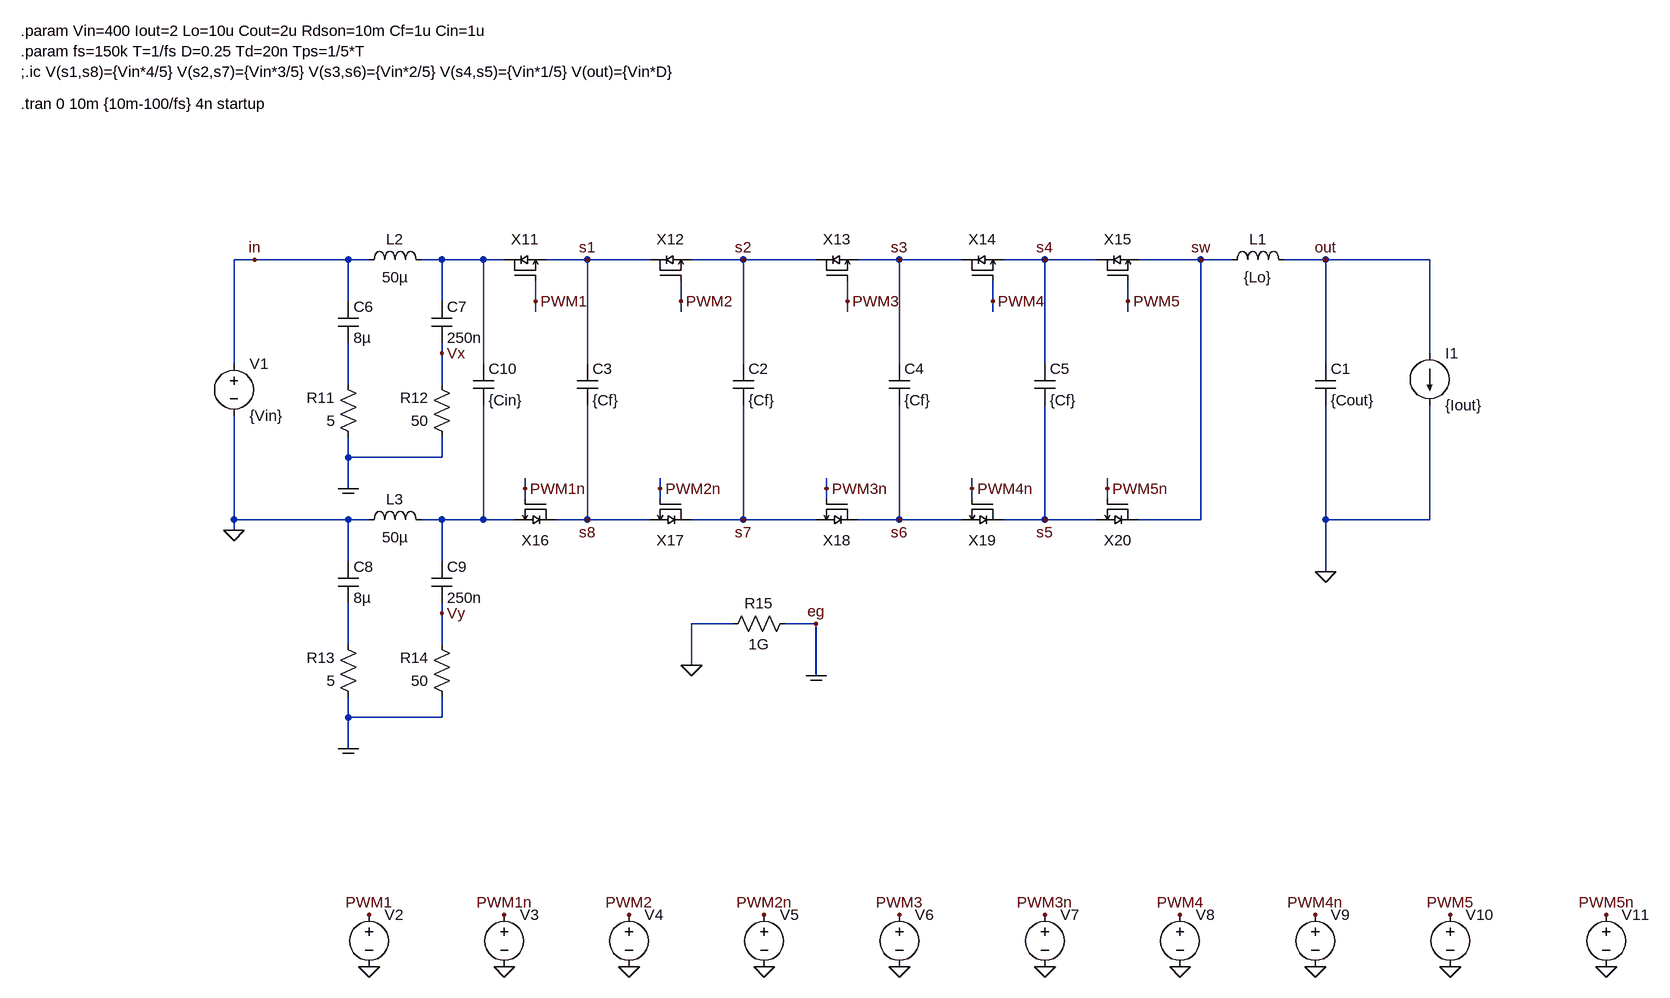
[diagram p0: schematic FCMLEMI.asc]
FCMLEMI.asc, the LTspice schematic file:
Version 4
SHEET 1 1772 988
WIRE -496 -176 -528 -176
WIRE -352 -176 -496 -176
WIRE -320 -176 -352 -176
WIRE -208 -176 -240 -176
WIRE -144 -176 -208 -176
WIRE -112 -176 -144 -176
WIRE 16 -176 -48 -176
WIRE 112 -176 16 -176
WIRE 256 -176 176 -176
WIRE 368 -176 256 -176
WIRE 496 -176 432 -176
WIRE 592 -176 496 -176
WIRE 720 -176 656 -176
WIRE 800 -176 720 -176
WIRE 960 -176 864 -176
WIRE 1008 -176 960 -176
WIRE 1152 -176 1088 -176
WIRE 1312 -176 1152 -176
WIRE -352 -112 -352 -176
WIRE -208 -112 -208 -176
WIRE -64 -112 -64 -144
WIRE 160 -112 160 -144
WIRE 416 -112 416 -144
WIRE 640 -112 640 -144
WIRE 848 -112 848 -144
WIRE -64 -96 -64 -112
WIRE 160 -96 160 -112
WIRE 416 -96 416 -112
WIRE 640 -96 640 -112
WIRE 848 -96 848 -112
WIRE -208 -32 -208 -48
WIRE 1312 -32 1312 -176
WIRE -528 -16 -528 -176
WIRE -144 -16 -144 -176
WIRE 16 -16 16 -176
WIRE 256 -16 256 -176
WIRE 496 -16 496 -176
WIRE 720 -16 720 -176
WIRE 1152 -16 1152 -176
WIRE -352 16 -352 -48
WIRE -208 16 -208 -32
WIRE -352 128 -352 96
WIRE -208 128 -208 96
WIRE -208 128 -352 128
WIRE -352 176 -352 128
WIRE -80 176 -80 160
WIRE 128 176 128 160
WIRE 384 176 384 160
WIRE 608 176 608 160
WIRE 816 176 816 160
WIRE -80 192 -80 176
WIRE 128 192 128 176
WIRE 384 192 384 176
WIRE 608 192 608 176
WIRE 816 192 816 176
WIRE -528 224 -528 64
WIRE -352 224 -528 224
WIRE -320 224 -352 224
WIRE -208 224 -240 224
WIRE -144 224 -144 48
WIRE -144 224 -208 224
WIRE -96 224 -144 224
WIRE 16 224 16 48
WIRE 16 224 -32 224
WIRE 112 224 16 224
WIRE 256 224 256 48
WIRE 256 224 176 224
WIRE 368 224 256 224
WIRE 496 224 496 48
WIRE 496 224 432 224
WIRE 592 224 496 224
WIRE 720 224 720 48
WIRE 720 224 656 224
WIRE 800 224 720 224
WIRE 960 224 960 -176
WIRE 960 224 864 224
WIRE 1152 224 1152 48
WIRE 1312 224 1312 48
WIRE 1312 224 1152 224
WIRE -528 240 -528 224
WIRE -352 288 -352 224
WIRE -208 288 -208 224
WIRE 1152 304 1152 224
WIRE -208 368 -208 352
WIRE 240 384 176 384
WIRE 368 384 320 384
WIRE -352 416 -352 352
WIRE -208 416 -208 368
WIRE 176 448 176 384
WIRE 368 464 368 384
WIRE -352 528 -352 496
WIRE -208 528 -208 496
WIRE -208 528 -352 528
WIRE -352 576 -352 528
FLAG -528 240 0
FLAG -320 832 PWM1
FLAG -112 832 PWM1n
FLAG 80 832 PWM2
FLAG 288 832 PWM2n
FLAG -496 -176 in
FLAG 960 -176 sw
FLAG 1152 -176 out
FLAG 128 176 PWM2n
FLAG 416 -112 PWM3
FLAG 384 176 PWM3n
FLAG -64 -112 PWM1
FLAG -80 176 PWM1n
FLAG 496 832 PWM3
FLAG 720 832 PWM3n
FLAG 640 -112 PWM4
FLAG 608 176 PWM4n
FLAG 928 832 PWM4
FLAG 1136 832 PWM4n
FLAG 160 -112 PWM2
FLAG 848 -112 PWM5
FLAG 816 176 PWM5n
FLAG 1344 832 PWM5
FLAG 1584 832 PWM5n
FLAG 16 -176 s1
FLAG 256 -176 s2
FLAG 496 -176 s3
FLAG 720 -176 s4
FLAG 720 224 s5
FLAG 496 224 s6
FLAG 256 224 s7
FLAG 16 224 s8
FLAG -112 912 0
FLAG -352 176 COM
FLAG -208 -32 Vx
FLAG -352 576 COM
FLAG -208 368 Vy
FLAG 176 448 0
FLAG 368 464 COM
FLAG -320 912 0
FLAG 80 912 0
FLAG 288 912 0
FLAG 496 912 0
FLAG 720 912 0
FLAG 1136 912 0
FLAG 928 912 0
FLAG 1344 912 0
FLAG 1584 912 0
FLAG 1152 304 0
FLAG 368 384 eg
SYMBOL voltage -528 -32 R0
WINDOW 123 0 0 Left 0
WINDOW 39 0 0 Left 0
SYMATTR InstName V1
SYMATTR Value {Vin}
SYMBOL ind 992 -160 R270
WINDOW 0 32 56 VTop 2
WINDOW 3 5 56 VBottom 2
SYMATTR InstName L1
SYMATTR Value {Lo}
SYMATTR SpiceLine Rser=9.33m
SYMBOL cap 1136 -16 R0
SYMATTR InstName C1
SYMATTR Value {Cout}
SYMATTR SpiceLine Rser=1m
SYMBOL cap 240 -16 R0
SYMATTR InstName C2
SYMATTR Value {Cf}
SYMATTR SpiceLine Rser=4.3m
SYMBOL voltage -320 816 R0
WINDOW 3 24 96 Invisible 2
WINDOW 123 0 0 Left 0
WINDOW 39 0 0 Left 0
SYMATTR Value PULSE(0 5 0 1n 1n {D*T} {T})
SYMATTR InstName V2
SYMBOL voltage -112 816 R0
WINDOW 3 24 96 Invisible 2
WINDOW 123 0 0 Left 0
WINDOW 39 0 0 Left 0
SYMATTR Value PULSE(0 5 {D*T+Td} 1n 1n {T-D*T-2*Td} {T})
SYMATTR InstName V3
SYMBOL voltage 80 816 R0
WINDOW 3 24 96 Invisible 2
WINDOW 123 0 0 Left 0
WINDOW 39 0 0 Left 0
SYMATTR Value PULSE(0 5 {Tps} 1n 1n {D*T} {T})
SYMATTR InstName V4
SYMBOL voltage 288 816 R0
WINDOW 3 24 96 Invisible 2
WINDOW 123 0 0 Left 0
WINDOW 39 0 0 Left 0
SYMATTR Value PULSE(0 5 {Tps+D*T+Td} 1n 1n {T-D*T-2*Td} {T})
SYMATTR InstName V5
SYMBOL cap 0 -16 R0
SYMATTR InstName C3
SYMATTR Value {Cf}
SYMATTR SpiceLine Rser=4.3m
SYMBOL voltage 496 816 R0
WINDOW 3 24 96 Invisible 2
WINDOW 123 0 0 Left 0
WINDOW 39 0 0 Left 0
SYMATTR Value PULSE(0 5 {Tps*2} 1n 1n {D*T} {T})
SYMATTR InstName V6
SYMBOL voltage 720 816 R0
WINDOW 3 24 96 Invisible 2
WINDOW 123 0 0 Left 0
WINDOW 39 0 0 Left 0
SYMATTR Value PULSE(0 5 {Tps*2+D*T+Td} 1n 1n {T-D*T-2*Td} {T})
SYMATTR InstName V7
SYMBOL cap 480 -16 R0
SYMATTR InstName C4
SYMATTR Value {Cf}
SYMATTR SpiceLine Rser=4.3m
SYMBOL voltage 928 816 R0
WINDOW 3 24 96 Invisible 2
WINDOW 123 0 0 Left 0
WINDOW 39 0 0 Left 0
SYMATTR Value PULSE(0 5 {Tps*3} 1n 1n {D*T} {T})
SYMATTR InstName V8
SYMBOL voltage 1136 816 R0
WINDOW 3 24 96 Invisible 2
WINDOW 123 0 0 Left 0
WINDOW 39 0 0 Left 0
SYMATTR Value PULSE(0 5 {Tps*3+D*T+Td} 1n 1n {T-D*T-2*Td} {T})
SYMATTR InstName V9
SYMBOL cap 704 -16 R0
SYMATTR InstName C5
SYMATTR Value {Cf}
SYMATTR SpiceLine Rser=4.3m
SYMBOL voltage 1344 816 R0
WINDOW 3 24 96 Invisible 2
WINDOW 123 0 0 Left 0
WINDOW 39 0 0 Left 0
SYMATTR Value PULSE(0 5 {Tps*4} 1n 1n {D*T} {T})
SYMATTR InstName V10
SYMBOL voltage 1584 816 R0
WINDOW 3 24 96 Invisible 2
WINDOW 123 0 0 Left 0
WINDOW 39 0 0 Left 0
SYMATTR Value PULSE(0 5 {Tps*4+D*T+Td} 1n 1n {T-D*T-2*Td} {T})
SYMATTR InstName V11
SYMBOL current 1312 -32 R0
WINDOW 123 0 0 Left 0
WINDOW 39 0 0 Left 0
SYMATTR InstName I1
SYMATTR Value {Iout}
SYMBOL IdealSW -80 -160 R0
SYMATTR InstName X11
SYMBOL IdealSW 144 -160 R0
SYMATTR InstName X12
SYMBOL IdealSW 400 -160 R0
SYMATTR InstName X13
SYMBOL IdealSW 624 -160 R0
SYMATTR InstName X14
SYMBOL IdealSW 832 -160 R0
SYMATTR InstName X15
SYMBOL IdealSW -64 208 R180
SYMATTR InstName X16
SYMBOL IdealSW 144 208 R180
SYMATTR InstName X17
SYMBOL IdealSW 400 208 R180
SYMATTR InstName X18
SYMBOL IdealSW 624 208 R180
SYMATTR InstName X19
SYMBOL IdealSW 832 208 R180
SYMATTR InstName X20
SYMBOL res -336 112 R180
WINDOW 0 36 76 Left 2
WINDOW 3 36 40 Left 2
SYMATTR InstName R11
SYMATTR Value 5
SYMBOL res -192 112 R180
WINDOW 0 36 76 Left 2
WINDOW 3 36 40 Left 2
SYMATTR InstName R12
SYMATTR Value 50
SYMBOL ind -336 -160 R270
WINDOW 0 32 56 VTop 2
WINDOW 3 5 56 VBottom 2
SYMATTR InstName L2
SYMATTR Value 50µ
SYMBOL cap -368 -112 R0
SYMATTR InstName C6
SYMATTR Value 8µ
SYMBOL cap -224 -112 R0
SYMATTR InstName C7
SYMATTR Value 250n
SYMBOL res -336 512 R180
WINDOW 0 36 76 Left 2
WINDOW 3 36 40 Left 2
SYMATTR InstName R13
SYMATTR Value 5
SYMBOL res -192 512 R180
WINDOW 0 36 76 Left 2
WINDOW 3 36 40 Left 2
SYMATTR InstName R14
SYMATTR Value 50
SYMBOL ind -336 240 R270
WINDOW 0 32 56 VTop 2
WINDOW 3 5 56 VBottom 2
SYMATTR InstName L3
SYMATTR Value 50µ
SYMBOL cap -368 288 R0
SYMATTR InstName C8
SYMATTR Value 8µ
SYMBOL cap -224 288 R0
SYMATTR InstName C9
SYMATTR Value 250n
SYMBOL res 224 400 R270
WINDOW 0 32 56 VTop 2
WINDOW 3 0 56 VBottom 2
SYMATTR InstName R15
SYMATTR Value 1G
SYMBOL cap -160 -16 R0
SYMATTR InstName C10
SYMATTR Value {Cin}
SYMATTR SpiceLine Rser=1u
TEXT -856 -528 Left 2 !.param Vin=400 Iout=2 Lo=10u Cout=2u Rdson=10m Cf=1u Cin=1u\n.param fs=150k T=1/fs D=0.25 Td=20n Tps=1/5*T\n;.ic V(s1,s8)={Vin*4/5} V(s2,s7)={Vin*3/5} V(s3,s6)={Vin*2/5} V(s4,s5)={Vin*1/5} V(out)={Vin*D}
TEXT -856 -416 Left 2 !.tran 0 10m {10m-100/fs} 4n startup

The netlist it stands for:
* FCMLEMI.asc
V1 in 0 {Vin}
L1 sw out {Lo} Rser=9.33m
C1 out 0 {Cout} Rser=1m
C2 s2 s7 {Cf} Rser=4.3m
V2 PWM1 0 PULSE(0 5 0 1n 1n {D*T} {T})
V3 PWM1n 0 PULSE(0 5 {D*T+Td} 1n 1n {T-D*T-2*Td} {T})
V4 PWM2 0 PULSE(0 5 {Tps} 1n 1n {D*T} {T})
V5 PWM2n 0 PULSE(0 5 {Tps+D*T+Td} 1n 1n {T-D*T-2*Td} {T})
C3 s1 s8 {Cf} Rser=4.3m
V6 PWM3 0 PULSE(0 5 {Tps*2} 1n 1n {D*T} {T})
V7 PWM3n 0 PULSE(0 5 {Tps*2+D*T+Td} 1n 1n {T-D*T-2*Td} {T})
C4 s3 s6 {Cf} Rser=4.3m
V8 PWM4 0 PULSE(0 5 {Tps*3} 1n 1n {D*T} {T})
V9 PWM4n 0 PULSE(0 5 {Tps*3+D*T+Td} 1n 1n {T-D*T-2*Td} {T})
C5 s4 s5 {Cf} Rser=4.3m
V10 PWM5 0 PULSE(0 5 {Tps*4} 1n 1n {D*T} {T})
V11 PWM5n 0 PULSE(0 5 {Tps*4+D*T+Td} 1n 1n {T-D*T-2*Td} {T})
I1 out 0 {Iout}
XX11 N001 PWM1 s1 IdealSW  ; pins D G S
XX12 s1 PWM2 s2 IdealSW  ; pins D G S
XX13 s2 PWM3 s3 IdealSW  ; pins D G S
XX14 s3 PWM4 s4 IdealSW  ; pins D G S
XX15 s4 PWM5 sw IdealSW  ; pins D G S
XX16 s8 PWM1n N003 IdealSW  ; pins D G S
XX17 s7 PWM2n s8 IdealSW  ; pins D G S
XX18 s6 PWM3n s7 IdealSW  ; pins D G S
XX19 s5 PWM4n s6 IdealSW  ; pins D G S
XX20 sw PWM5n s5 IdealSW  ; pins D G S
R11 eg N002 5
R12 eg Vx 50
L2 in N001 50µ
C6 in N002 8µ
C7 N001 Vx 250n
R13 eg N004 5
R14 eg Vy 50
L3 0 N003 50µ
C8 0 N004 8µ
C9 N003 Vy 250n
R15 0 eg 1G
C10 N001 N003 {Cin} Rser=1u
.param Vin=400 Iout=2 Lo=10u Cout=2u Rdson=10m Cf=1u Cin=1u
.param fs=150k T=1/fs D=0.25 Td=20n Tps=1/5*T
;.ic V(s1,s8)={Vin*4/5} V(s2,s7)={Vin*3/5} V(s3,s6)={Vin*2/5} V(s4,s5)={Vin*1/5} V(out)={Vin*D}
.tran 0 10m {10m-100/fs} 4n startup
.backanno
.end